# EAGLE schematic ATESLEME (EAGLE 9.6.2)
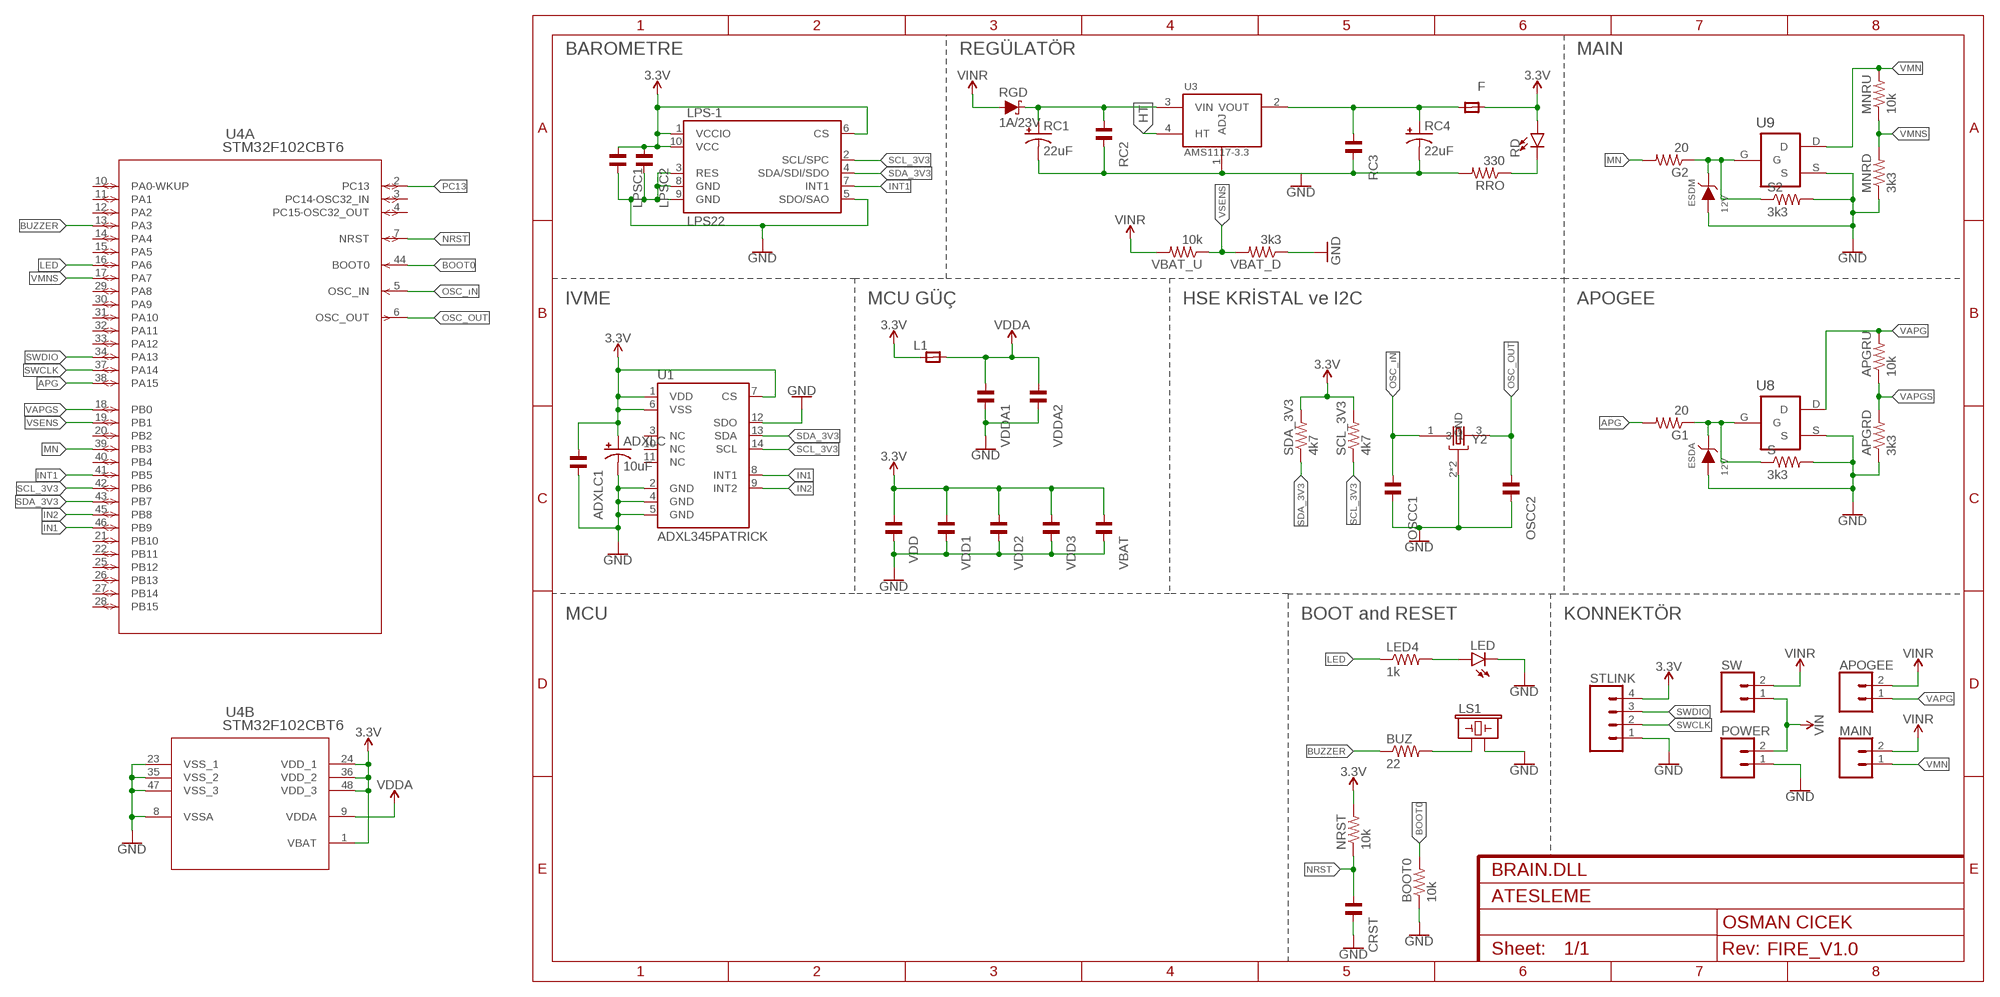
[diagram p0: schematic, sheet 1]
FRAME1 (FRAME-A4L): ATESLEME: PART1; CNAME: BRAIN.DLL; CREVISION: FIRE_V1.0; DESIGNER: OSMAN CICEK

## Parts
ADXLC  10uF  10UF-POLAR-EIA3216-16V-10%(TANT)  [EIA3216]
ADXLC1  0.1uF  RC-MASTER-SMD_C_1206MP  [RC-MASTER-SMD_C1206MP]
APGRD  3k3  10OHM-1206-1/4W-1%  [1206]
APGRU  10k  10OHM-1206-1/4W-1%  [1206]
APOGEE  CONN_023.5MM-NO_SILK  [SCREWTERMINAL-3.5MM-2-NS]
BOOT0  10k  10OHM-1206-1/4W-1%  [1206]
BUZ  22  10OHM-1206-1/4W-1%  [1206]
CRST  100nF  RC-MASTER-SMD_C_1206MP  [RC-MASTER-SMD_C1206MP]
ESDA  12V  WE-TVSP_DO-214AC_400W_UNI_824500102  [WE-TVSP_DO-214AC_UNIDIRECTIONAL]
ESDM  12V  WE-TVSP_DO-214AC_400W_UNI_824500102  [WE-TVSP_DO-214AC_UNIDIRECTIONAL]
F  0.75A  RC-MASTER-SMD_FB_1206MP  [RC-MASTER-SMD_L1206MP]
G1  20  10OHM-1206-1/4W-1%  [1206]
G2  20  10OHM-1206-1/4W-1%  [1206]
L1  RC-MASTER-SMD_FB_1206MP  [RC-MASTER-SMD_L1206MP]
LED  GREEN  LED1206  [LED-1206]
LED4  1k  10OHM-1206-1/4W-1%  [1206]
LPS-1  LPS22  LPS2XH-22  [LPS22H]
LPSC1  4.7uF  RC-MASTER-SMD_C_1206MP  [RC-MASTER-SMD_C1206MP]
LPSC2  100nF  RC-MASTER-SMD_C_1206MP  [RC-MASTER-SMD_C1206MP]
LS1  BUZZER-PTH  [BUZZER-12MM]
MAIN  CONN_023.5MM-NO_SILK  [SCREWTERMINAL-3.5MM-2-NS]
MNRD  3k3  10OHM-1206-1/4W-1%  [1206]
MNRU  10k  10OHM-1206-1/4W-1%  [1206]
NRST  10k  10OHM-1206-1/4W-1%  [1206]
OSCC1  25pF  RC-MASTER-SMD_C_1206MP  [RC-MASTER-SMD_C1206MP]
OSCC2  25pF  RC-MASTER-SMD_C_1206MP  [RC-MASTER-SMD_C1206MP]
POWER  CONN_023.5MM-NO_SILK  [SCREWTERMINAL-3.5MM-2-NS]
RC1  22uF  10UF-POLAR-EIA3528-20V-10%(TANT)  [EIA3528]
RC2  100nF  RC-MASTER-SMD_C_1206MP  [RC-MASTER-SMD_C1206MP]
RC3  100nF  RC-MASTER-SMD_C_1206MP  [RC-MASTER-SMD_C1206MP]
RC4  22uF  10UF-POLAR-EIA3528-20V-10%(TANT)  [EIA3528]
RD  Red  LED1206  [LED-1206]
RGD  1A/23V  DIODE-SCHOTTKY-BAT20J  [SOD-323]
RRO  330  10OHM-1206-1/4W-1%  [1206]
S  3k3  10OHM-1206-1/4W-1%  [1206]
S2  3k3  10OHM-1206-1/4W-1%  [1206]
SCL_3V3  4k7  10OHM-1206-1/4W-1%  [1206]
SDA_3V3  4k7  10OHM-1206-1/4W-1%  [1206]
STLINK  CONN_04  [1X04]
SW  CONN_023.5MM-NO_SILK  [SCREWTERMINAL-3.5MM-2-NS]
U1  ADXL345PATRICK  [LGA14_1:1_PATRICK]
U3  AMS1117-3.3  [SOT229P700X180-4N]
U4  STM32F102CBT6  [LQFP48-7X7MM]
U8  IRLML6344TRPBF  [SOT95P240X112-3N]
U9  IRLML6344TRPBF  [SOT95P240X112-3N]
VBAT  100nF  RC-MASTER-SMD_C_1206MP  [RC-MASTER-SMD_C1206MP]
VBAT_D  3k3  10OHM-1206-1/4W-1%  [1206]
VBAT_U  10k  10OHM-1206-1/4W-1%  [1206]
VDD  4.7uF  RC-MASTER-SMD_C_1206MP  [RC-MASTER-SMD_C1206MP]
VDD1  100nF  RC-MASTER-SMD_C_1206MP  [RC-MASTER-SMD_C1206MP]
VDD2  100nF  RC-MASTER-SMD_C_1206MP  [RC-MASTER-SMD_C1206MP]
VDD3  100nF  RC-MASTER-SMD_C_1206MP  [RC-MASTER-SMD_C1206MP]
VDDA1  1uF  RC-MASTER-SMD_C_1206MP  [RC-MASTER-SMD_C1206MP]
VDDA2  100nF  RC-MASTER-SMD_C_1206MP  [RC-MASTER-SMD_C1206MP]
Y2  ABM2B-8.000MHZ-10-1-U-T  ABM3B-26.000MHZ-10-1-U-T  [OSCCC500X320X110-4N]

## Nets
3.3V: ADXLC1.1 ADXLC.+ F.2 L1.1 LPS-1.1(VCCIO) LPS-1.6(CS) LPS-1.10(VCC) LPSC1.1 LPSC2.1 NRST.2 RD.A SCL_3V3.2 SDA_3V3.2 STLINK.4 U1.1(VDD) U1.6(VSS) U1.7(CS) U4.1(B:VBAT) U4.24(B:VDD_1) U4.36(B:VDD_2) U4.48(B:VDD_3) VBAT.1 VDD1.1 VDD2.1 VDD3.1 VDD.1
APG: G1.2 U4.38(A:PA15)
BOOT0: BOOT0.2 U4.44(A:BOOT0)
BUZZER: BUZ.1 U4.13(A:PA3)
GND: ADXLC1.2 ADXLC.- APGRD.1 BOOT0.1 CRST.2 ESDA.2(A) ESDM.2(A) LED.C LPS-1.3(RES) LPS-1.5(SDO/SAO) LPS-1.8(GND) LPS-1.9(GND) LPSC1.2 LPSC2.2 LS1.- MNRD.1 OSCC1.2 OSCC2.2 POWER.1 RC1.C(-) RC2.2 RC3.2 RC4.C(-) RRO.2 S2.2 S.2 STLINK.1 U1.2(GND) U1.4(GND) U1.5(GND) U1.12(SDO) U3.1(ADJ) U4.8(B:VSSA) U4.23(B:VSS_1) U4.35(B:VSS_2) U4.47(B:VSS_3) U8.S U9.S VBAT.2 VBAT_D.1 VDD1.2 VDD2.2 VDD3.2 VDD.2 VDDA1.2 VDDA2.2 Y2.2(GND) Y2.4(GND)
HT: U3.4(HT)
IN1: U1.8(INT1) U4.46(A:PB9)
IN2: U1.9(INT2) U4.45(A:PB8)
INT1: LPS-1.7(INT1) U4.41(A:PB5)
LED: LED4.1 U4.16(A:PA6)
MN: G2.2 U4.39(A:PB3)
N$1: F.1 RC3.1 RC4.A(+) U3.2(VOUT)
N$2: RD.C RRO.1
N$8: ESDM.1(C) G2.1 S2.1 U9.G
N$10: LED4.2 LED.A
N$13: BUZ.2 LS1.+
N$14: ESDA.1(C) G1.1 S.1 U8.G
NRST: CRST.1 NRST.1 U4.7(A:NRST)
OSC_OUT: OSCC2.1 U4.6(A:OSC_OUT) Y2.3
OSC_ıN: OSCC1.1 U4.5(A:OSC_IN) Y2.1
PC13: U4.2(A:PC13)
SCL_3V3: LPS-1.2(SCL/SPC) SCL_3V3.1 U1.14(SCL) U4.42(A:PB6)
SDA_3V3: LPS-1.4(SDA/SDI/SDO) SDA_3V3.1 U1.13(SDA) U4.43(A:PB7)
SWCLK: STLINK.2 U4.37(A:PA14)
SWDIO: STLINK.3 U4.34(A:PA13)
VAPG: APGRU.2 APOGEE.1 U8.D
VAPGS: APGRD.2 APGRU.1 U4.18(A:PB0)
VCC: POWER.2 SW.1 ; supply symbol labelled VIN
VDDA: L1.2 U4.9(B:VDDA) VDDA1.1 VDDA2.1
VIN: APOGEE.2 MAIN.2 RGD.A SW.2 VBAT_U.2 ; supply symbol labelled VINR
VMN: MAIN.1 MNRU.2 U9.D
VMNS: MNRD.2 MNRU.1 U4.17(A:PA7)
VNR: RC1.A(+) RC2.1 RGD.C U3.3(VIN)
VSENS: U4.19(A:PB1) VBAT_D.2 VBAT_U.1
Unconnected: U1.3(NC) U1.10(NC) U1.11(NC) U4.3(A:PC14-OSC32_IN) U4.4(A:PC15-OSC32_OUT) U4.10(A:PA0-WKUP) U4.11(A:PA1) U4.12(A:PA2) U4.14(A:PA4) U4.15(A:PA5) U4.20(A:PB2) U4.21(A:PB10) U4.22(A:PB11) U4.25(A:PB12) U4.26(A:PB13) U4.27(A:PB14) U4.28(A:PB15) U4.29(A:PA8) U4.30(A:PA9) U4.31(A:PA10) U4.32(A:PA11) U4.33(A:PA12) U4.40(A:PB4)

## Notes on the sheet
- BAROMETRE | REGÜLATÖR | MAIN
- IVME | MCU GÜÇ | HSE KRİSTAL ve I2C | APOGEE
- MCU | BOOT and RESET | KONNEKTÖR

## Library data of the parts
ADXLC = SparkFun-Capacitors:10UF-POLAR: 10.0µF polarized capacitors A capacitor is a passive two-terminal electrical component used to store electrical energy temporarily in an electric field.; PROD_ID: CAP-00811
ADXLC1 CRST LPSC1 LPSC2 OSCC1 OSCC2 RC2 RC3 VBAT VDD VDD1-VDD3 VDDA1 VDDA2 = 52101-101-REV-A_v16:RC-MASTER-SMD_C_: NON-POLARIZED CAP
APGRD APGRU BOOT0 BUZ G1 G2 LED4 MNRD MNRU NRST RRO S S2 SCL_3V3 SDA_3V3 VBAT_D VBAT_U = SparkFun-Resistors:10OHM: 10Ω resistor A resistor is a passive two-terminal electrical component that implements electrical resistance as a circuit element. Resistors act to reduce current flow, and, at the same time, act to lower voltage levels within circuits. - Wikipedia; PROD_ID: RES-08705; VALUE: 10
APOGEE MAIN POWER SW = SparkFun-Connectors:CONN_02: Multi connection point. Often used as Generic Header-pin footprint for 0.1 inch spaced/style header connections On any of the 0.1 inch spaced packages, you can populate with these: Break Away Headers - Straight <https://www.sparkfun.com/products/116> (PRT-00116) Break Away Male Headers - Right Angle <https://www.sparkfun.com/products/553> (PRT-00553) Female Headers <https://www.sparkfun.com/products/115> (PRT-00115) Break Away Headers - Machine Pin <https://www.sparkfun.com/products/117> (PRT-00117) Break Away Female Headers - Swiss Machine Pin <https://www.sparkfun.com/products/743> (PRT-00743) For SCREWTERMINALS and SPRING TERMINALS visit here: Screw Terimnals on SparkFun.com <https://www.sparkfun.com/search/results?term=Screw+Terminals> (5mm/3.5mm/2.54mm spacing) This device is also useful as a general connection point to wire up your design to another part of your project. Our various solder wires solder well into these plated through hole pads. Hook-Up Wire - Assortment (Stranded, 22 AWG) <https://www.sparkfun.com/products/11375> (PRT-11375) Hook-Up Wire - Assortment (Solid Core, 22 AWG) <https://www.sparkfun.com/products/11367> (PRT-11367) View the entire wire category on our website here <https://www.sparkfun.com/categories/141> Special notes: Molex polarized connector foot print use with: PRT-08233 with associated crimp pins and housings. 2.54_SCREWTERM for use with PRT-10571. 3.5mm Screw Terminal footprints for PRT-08084 5mm Screw Terminal footprints for use with PRT-08432; PROD_ID: CONN-08399
ESDA ESDM = Wurth_EMC Components_WE-TVSP:WE-TVSP_DO-214AC_400W_UNI: WE-TVSP Power TVS Diode Characteristics Low Profile Package Glass passivated Juction Excellent clamping capability Fast response time MSL Level 1, per J-STD-020 Classification of the plastic case: UL 94 V-0 Safety certification UL 497B, E478010 Identical design: - DO-214AC = SMAJ - DO-214AA = SMBJ - DO-214AB = SMCJ/SMDJ Applications Ideal to protect the I/O Interfaces, Bus Voltage and other circuits of sensetive electronic equipment against voltage transiensts <https://www.we-online.com/catalog/media/o55793v209%20WE-TVSP_600W-3000W_D0214AA_4C.jpg> Details see: https://www.we-online.com/catalog/en/WE-TVSP/ Updated by Ella Wu 2020-07-20 2020 (C) Würth Elektronik; DATASHEET-URL: https://www.we-online.com/catalog/datasheet/824500102.pdf; IPEAK: 2.5A; MOUNT: SMT; PART-NUMBER: 824500102; PDISS: 400W; VALUE: 100V; VBR: 117V; VCLAMP: 162V
F L1 = 52101-101-REV-A_v16:RC-MASTER-SMD_FB_: FERRITE BEAD
LED RD = SparkFun-LED:LED: LED (Generic) Standard schematic elements and footprints for 5mm, 3mm, 1206, and 0603 sized LEDs. Generic LEDs with no color specified.
LPS-1 = Arduino-Sensors:LPS2XH; CODE-ARDUINO: A5390; DATASHEET: https://www.st.com/content/ccc/resource/technical/document/datasheet/bf/c1/4f/23/61/17/44/8a/DM00140895.pdf/files/DM00140895.pdf/jcr:content/translations/en.DM00140895.pdf; DISTRIBUTOR-LINK: https://www.digikey.com/product-detail/en/stmicroelectronics/LPS22HBTR/497-16265-1-ND/5799917; DISTRIBUTOR-PN: 497-16265-1-ND; MANUFACTURER: ST; MANUFACTURER-PN: LPS22HBTR
LS1 = SparkFun-Electromechanical:BUZZER: Buzzer Small round buzzers that operate around the audible 2kHz range. You can use these as speakers to create simple music or user interfaces. Variant Overview: PTH - Mini Speaker - PC Mount 12mm 2.048kHz <https://www.sparkfun.com/products/7950> PTH_KIT - Mini Speaker - PC Mount 12mm 2.048kHz <https://www.sparkfun.com/products/7950> KIT simplifies soldering by adding stop mask to one side of the pads. PTH_NO_SILK - Mini Speaker - PC Mount 12mm 2.048kHz <https://www.sparkfun.com/products/7950> No silkscreen indicator of buzzer outline. PTH_KIT_NO_SILK - Mini Speaker - PC Mount 12mm 2.048kHz <https://www.sparkfun.com/products/7950> KIT package w/o silkscreen SMD - Buzzer Audio Magnetic (CCV-084B16) SMD buzzer used on, e.g. the LilyPad Buzzer <https://www.sparkfun.com/products/8463> and RFID USB Reader <https://www.sparkfun.com/products/9963>. SMD_KIT - Buzzer Audio Magnetic (CCV-084B16) SMD Buzzer with elongated pins to make soldering easier. Used on the SparkFun Simon Says - Surface Mount Soldering Kit <https://www.sparkfun.com/products/10935>.; PROD_ID: COMP-08253; SF_SKU: COM-07950
RC1 RC4 = SparkFun-Capacitors:10UF-POLAR: 10.0µF polarized capacitors A capacitor is a passive two-terminal electrical component used to store electrical energy temporarily in an electric field.; PROD_ID: CAP-08063; VALUE: 10uF
RGD = SparkFun-DiscreteSemi:DIODE-SCHOTTKY: Schottky diode A Schottky diode is a semiconductor diode which has a low forward voltage drop and a very fast switching action.; PROD_ID: DIO-11623; VALUE: 1A/23V/620mV
STLINK = SparkFun-Connectors:CONN_04: Multi connection point. Often used as Generic Header-pin footprint for 0.1 inch spaced/style header connections On any of the 0.1 inch spaced packages, you can populate with these: Break Away Headers - Straight <https://www.sparkfun.com/products/116> (PRT-00116) Break Away Male Headers - Right Angle <https://www.sparkfun.com/products/553> (PRT-00553) Female Headers <https://www.sparkfun.com/products/115> (PRT-00115) Break Away Headers - Machine Pin <https://www.sparkfun.com/products/117> (PRT-00117) Break Away Female Headers - Swiss Machine Pin <https://www.sparkfun.com/products/743> (PRT-00743) For SCREWTERMINALS and SPRING TERMINALS visit here: Screw Terimnals on SparkFun.com <https://www.sparkfun.com/search/results?term=Screw+Terminals> (5mm/3.5mm/2.54mm spacing) This device is also useful as a general connection point to wire up your design to another part of your project. Our various solder wires solder well into these plated through hole pads. Hook-Up Wire - Assortment (Stranded, 22 AWG) <https://www.sparkfun.com/products/11375> (PRT-11375) Hook-Up Wire - Assortment (Solid Core, 22 AWG) <https://www.sparkfun.com/products/11367> (PRT-11367) View the entire wire category on our website here <https://www.sparkfun.com/categories/141> Special notes: Molex polarized connector foot print use with SKU : PRT-08231 with associated crimp pins and housings. 1MM SMD Version SKU: PRT-10208; PROD_ID: CONN-09696
U1 = Testing:ADXL345
U3 = AMS1117-3.3:AMS1117-3.3: Sot223/Pkg 1-Amp 3.3-Volt Low Drop Out Voltage Regulatator; AVAILABILITY: Unavailable; DESCRIPTION: Sot223/Pkg 1-Amp 3.3-Volt Low Drop Out Voltage Regulatator; MF: Advanced Monolithic Systems; MP: AMS1117-3.3; PACKAGE: SOT-89 ams; PRICE: None
U4 = STM32F102CBT6:STM32F102CBT6; BUILT_BY: EMA_UL_Team; COPYRIGHT: Copyright (C) 2018 Accelerated Designs. All rights reserved; MANUFACTURER_PART_NUMBER: STM32F102CBT6; SOURCELIBRARY: Updates_to_database_2020-10-19; VENDOR: STMicroelectronics
U8 U9 = IRLML6344TRPBF:IRLML6344TRPBF: Power MOSFET Check prices <https://pricing.snapeda.com/parts/IRLML6344TRPBF/Infineon%20Technologies/view-part?ref=eda>; AVAILABILITY: Good; DESCRIPTION: N-Channel 30V 5A (Ta) 1.3W (Ta) Surface Mount Micro3™/SOT-23; MF: Infineon Technologies; MP: IRLML6344TRPBF; PACKAGE: SOT-23 Multicomp; PRICE: None; PURCHASE-URL: https://pricing.snapeda.com/search/part/IRLML6344TRPBF/?ref=eda
Y2 = ABM3B-26.000MHZ-10-1-U-T:ABM3B-26.000MHZ-10-1-U-T: Ceramic SMD Crystal Check prices <https://pricing.snapeda.com/parts/ABM3B-26.000MHZ-10-1-U-T/Abracon/view-part?ref=eda>; AVAILABILITY: Good; DESCRIPTION: 26MHz ±10ppm Crystal 10pF 50 Ohms 4-SMD, No Lead; MF: Abracon; MP: ABM3B-26.000MHZ-10-1-U-T; PACKAGE: SMD-4 Abracon LLC; PRICE: None; PURCHASE-URL: https://pricing.snapeda.com/search/part/ABM3B-26.000MHZ-10-1-U-T/?ref=eda